# Altium project EDP_V3.PrjPcb
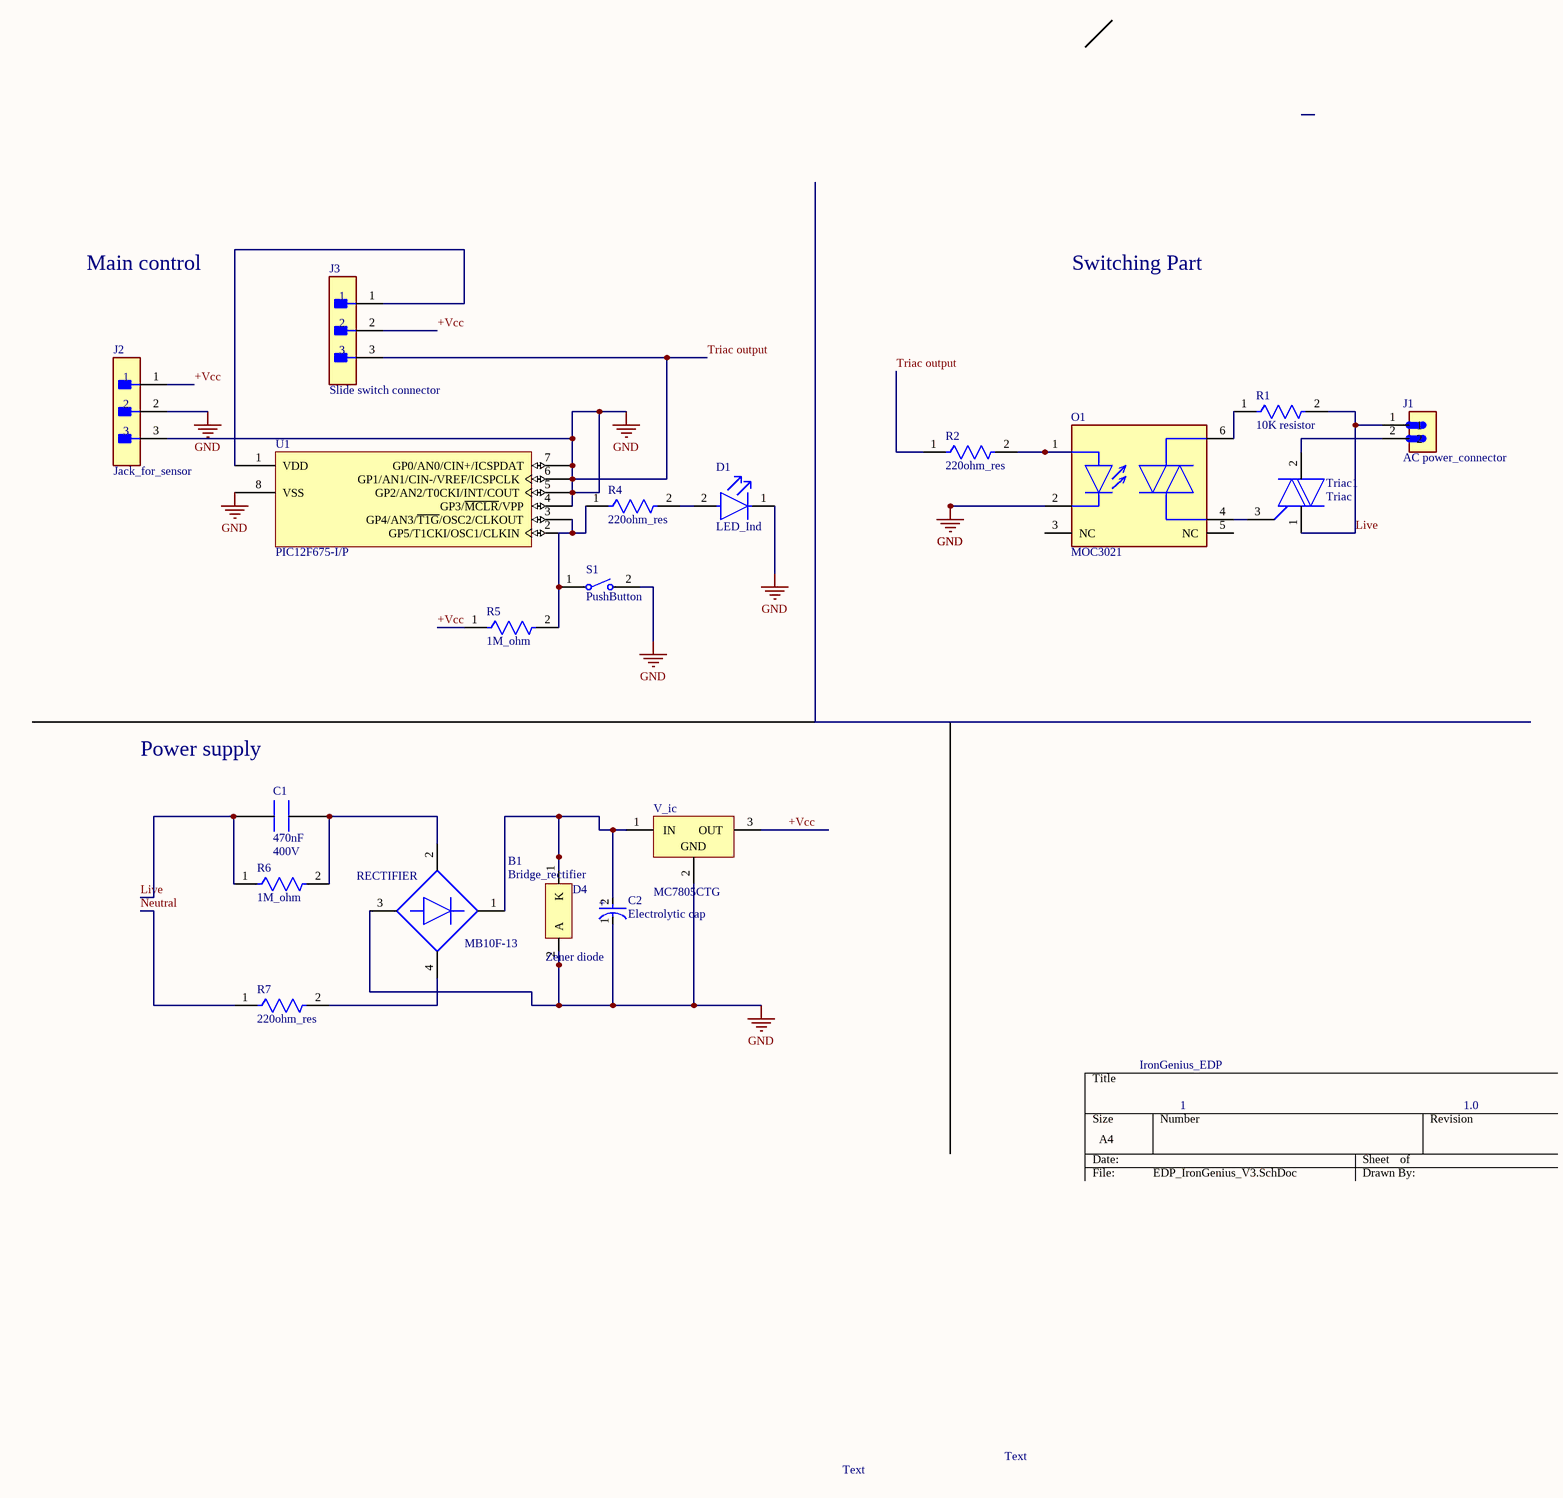
[diagram p0: EDP_IronGenius_V3.SchDoc]
1 sheet, 19 parts. Net scope: global (net labels, ports and power ports of the same name join across sheets).
Board file: EDP_V3.PcbDoc

## Sheet EDP_IronGenius_V3.SchDoc: IronGenius_EDP
size A4; Revision: 1.0; SheetNumber: 1; SheetTotal: 1

### Parts
B1  Bridge_rectifier  Manufacturer Part Number: MB10F-13  Diode Type: RECTIFIER  [Bridge rectifier]
C1  value 470nF  Rated AC Voltage (URac): 400V  [Capacitor 470nF 400V AC]
C2  Electrolytic cap  [Electrolytic cap]
D1  LED_Ind  [LED_ind]
D4  Zener diode  [Diode]
J1  AC power_connector  [AC power_connector]
J2  Jack_for_sensor  [Sensor_jack]
J3  Slide switch connector  [Sensor_jack]
O1  MOC3021  [DIP6]
R1  10K resistor  [10K resistor]
R2  220ohm_res  [220ohm_res]
R4  220ohm_res  [220ohm_res]
R5  1M_ohm  [1M_om]
R6  1M_ohm  [1M_om]
R7  220ohm_res  [220ohm_res]
S1  PushButton  [PushButton]
Triac1  Triac  [Triac BTA16-600]
U1  PIC12F675-I/P  [PDIP300-P8]
V_ic  MC7805CTG  [IC7805]

### Nets
Triac output: B1.3(-) C2.1(C) D1.1(C) D4.2(A) J2.2 J2.3 J3.3 O1.2(C) R2.1 S1.2 U1.4(GP3/~{MCLR}/VPP) U1.5(GP2/AN2/T0CKI/INT/COUT) U1.6(GP1/AN1/CIN-/VREF/ICSPCLK) U1.7(GP0/AN0/CIN+/ICSPDAT) U1.8(VSS) V_ic.2(GND)  [also labelled GND]
+Vcc: J2.1 J3.2 R5.1 V_ic.3(OUT)
Live: C1.P10 J1.1 R1.2 R6.1 Triac1.1(A1)
Neutral: R7.1
NetB1_1: B1.1(+) C2.2(A) D4.1(K) V_ic.1(IN)
NetB1_2: B1.2(1_~) C1.P9 R6.2
NetB1_4: B1.4(2_~) R7.2
NetD1_2: D1.2(A) R4.2
NetJ1_2: J1.2 Triac1.2(A2)
NetJ3_1: J3.1 U1.1(VDD)
NetO1_1: O1.1(A) R2.2
NetO1_4: O1.4(1_MAIN_TERM.) Triac1.3(G)
NetO1_6: O1.6(2_MAIN_TERM.) R1.1
NetR4_1: R4.1 R5.2 S1.1 U1.2(GP5/T1CKI/OSC1/CLKIN) U1.3(GP4/AN3/~{T1G}/OSC2/CLKOUT)

Not connected (* = marked no-connect by the designer): O1 3(NC) 5(NC)

### Notes on the sheet
- Main control
- Switching Part
- Power supply
- Text
- (in symbol Electrolytic cap) +

### Library data of the parts
B1 = Bridge_rectifier: Bridge Rectifier Diode, 1 Phase, 0.8A, 1000V V(RRM), Silicon; Manufacturer: Diodes; Supplier: Digikey; Supplier Part Number: MB10F-13DICT-ND; RoHS: Yes; Category: Diodes; Stock: 10908; Pricing: 1=0.56, 10=0.346, 100=0.2202, 500=0.16594, 1000=0.13963, 2000=0.13364 (USD); Terminal Finish: Tin; JESD-609 Code: e3; RoHS Compliant: Yes; Reach SVHC Compliant: No; ComponentLink1URL: https://datasheet.ciiva.com:443/pdfs/VipMasterIC/IC/DIOD/DIOD-S-A0003097097/DIOD-S-A0003097097-1.pdf?src-supplier=IHS+Markit; ComponentLink1Description: https://datasheet.ciiva.com:443/pdfs/VipMasterIC/IC/DIOD/DIOD-S-A0003097097/DIOD-S-A0003097097-1.pdf?src-supplier=IHS+Markit; ComponentLink2URL: https://www.diodes.com/assets/Datasheets/MB10F.pdf?src-supplier=Digikey; ComponentLink2Description: https://www.diodes.com/assets/Datasheets/MB10F.pdf?src-supplier=Digikey
C1 = Component_2: Film Capacitor, Polypropylene, 630V, 5% +Tol, 5% -Tol, 0.47uF, Through Hole Mount; pin to pad: P9>1 P10>2; Manufacturer: KEMET; Manufacturer Part Number: R76PR3470SE30J; Additional Feature: RATED AC VOLTAGE (V): 400; Supplier: Digikey; Supplier Part Number: 399-7615-ND; RoHS: Yes; Category: Film Capacitors; Stock: 336; Pricing: 1=3.32, 10=2.388, 50=1.9644, 480=1.56423, 960=1.47382, 1440=1.42641, 2880=1.35362, 5280=1.29756 (USD); Mounting Technology: Through Hole; Pins: 2; Dielectric Material: Polypropylene; Package Shape: Rectangular; Min Operating Temperature: -55°C; Max Operating Temperature: 85°C; Capacitor Type: FILM; Tolerance  (fill in as +-): 5%; Package Style: RadialMeter; Packaging: Bulk; Tolerance (fill in as +-): 5%; Rated DC Voltage (URdc): 630V; Termination: Wire; Length: 32mm; Width: 13mm; Height: 22mm; Terminal Pitch: 27.5mm; Reach SVHC Compliant: Yes; RoHS Compliant: Yes; ComponentLink1URL: https://datasheet.ciiva.com:443/pdfs/VipMasterIC/IC/KEME/KEME-S-A0009156830/KEME-S-A0009156830-1.pdf?src-supplier=IHS+Markit; ComponentLink1Description: https://datasheet.ciiva.com:443/pdfs/VipMasterIC/IC/KEME/KEME-S-A0009156830/KEME-S-A0009156830-1.pdf?src-supplier=IHS+Markit; ComponentLink2URL: http://www.mouser.com/ds/2/212/KEM_F3034_R76-458534.pdf?src-supplier=Mouser; ComponentLink2Description: http://www.mouser.com/ds/2/212/KEM_F3034_R76-458534.pdf?src-supplier=Mouser; ComponentLink3URL: https://search.kemet.com/component-edge/download/datasheet/R76PR3470SE30J.pdf?src-supplier=Digikey; ComponentLink3Description: https://search.kemet.com/component-edge/download/datasheet/R76PR3470SE30J.pdf?src-supplier=Digikey
C2 = Electrolytic cap: Aluminum Electrolytic Capacitor, Polarized, Aluminum (wet), 50V, 20% +Tol, 20% -Tol, 220uF, Through Hole Mount; Manufacturer: Panasonic; Manufacturer Part Number: EEU-FR1H221B; Manufacturer Series: FR; Dielectric Material: Aluminium; Leakage Current: 110uA; Ripple Current: 1.155A; Tan Delta: 0.1; Supplier: Digikey; Supplier Part Number: P15375CT-ND; RoHS: Yes; Category: Aluminum Electrolytic Capacitors; Pricing: 1=0.84, 10=0.53, 50=0.3992, 100=0.358 (USD); Mounting Technology: Through Hole; Pins: 2; Terminal Finish: Tin; Package Shape: Cylindrical; Min Operating Temperature: -40°C; Max Operating Temperature: 105°C; Polarity: Polarized; Value: 220uF; Capacitor Type: Aluminium; Tolerance  (fill in as +-): 20%; Package Style: RadialMeter; Packaging: Tape and Reel; Tolerance (fill in as +-): 20%; Rated DC Voltage (URdc): 50V; Termination: Wire; JESD-609 Code: e3; Series: EEU-FR; Diameter: 10mm; Length: 16mm; Terminal Pitch: 5mm; Reach SVHC Compliant: Yes; RoHS Compliant: Yes; ComponentLink1URL: https://datasheet.ciiva.com:443/pdfs/VipMasterIC/IC/PANA/PANA-S-A0009000947/PANA-S-A0009000947-1.pdf?src-supplier=IHS+Markit; ComponentLink1Description: https://datasheet.ciiva.com:443/pdfs/VipMasterIC/IC/PANA/PANA-S-A0009000947/PANA-S-A0009000947-1.pdf?src-supplier=IHS+Markit
D1 = LED_Ind: Single Color LED, Yellow, Tinted Diffused, T-1, 3mm; Manufacturer: Broadcom Avago; Shape: Round; Channels: 1; Forward Current: 7mA; Forward Voltage: 2.7V; Luminous Intensity-Nom: 2.1mcd; Viewing Angle: 50°; Lens Style: Diffused,Tinted; Overall Height: 4.445mm; Supplier: Digikey; Supplier Part Number: 516-1309-ND; Manufacturer Part Number: HLMP-1719; RoHS: Yes; Category: LEDs; Stock: 87102; Pricing: 1=0.42, 10=0.287, 100=0.2048, 500=0.1675, 1000=0.15521, 2000=0.14474, 6000=0.13128, 10000=0.12612, 26000=0.11801 (USD); Mounting Technology: Radial; Pins: 2; Color: Yellow; Color@wavelength: Yellow; Terminal Finish: Tin; Min Operating Temperature: -40°C; Max Operating Temperature: 100°C; Optoelectronic Device Type: SINGLE COLOR LED; Packaging: Bulk; JESD-609 Code: e3; T-code: T-1; Terminal Pitch: 2.54mm; Size: 3mm; Reach SVHC Compliant: Yes; RoHS Compliant: Yes; ComponentLink1URL: https://datasheet.ciiva.com:443/pdfs/VipMasterIC/IC/AVGO/AVGOS05570/AVGOS05570-1.pdf?src-supplier=IHS+Markit; ComponentLink1Description: https://datasheet.ciiva.com:443/pdfs/VipMasterIC/IC/AVGO/AVGOS05570/AVGOS05570-1.pdf?src-supplier=IHS+Markit; ComponentLink2URL: https://datasheet.ciiva.com/11773/0900766b800204ad-11773897.pdf?src-supplier=Rs; ComponentLink2Description: https://datasheet.ciiva.com/11773/0900766b800204ad-11773897.pdf?src-supplier=Rs; ComponentLink3URL: https://datasheet.ciiva.com/19482/253673-19482303.pdf?src-supplier=Jameco; ComponentLink3Description: https://datasheet.ciiva.com/19482/253673-19482303.pdf?src-supplier=Jameco; ComponentLink4URL: https://datasheet.ciiva.com/15117/getdatasheetpartid-111138-15117505.pdf?src-supplier=Verical; ComponentLink4Description: https://datasheet.ciiva.com/15117/getdatasheetpartid-111138-15117505.pdf?src-supplier=Verical; ComponentLink5URL: https://datasheet.ciiva.com/1244/1715378-1244676.pdf?src-supplier=Element14; ComponentLink5Description: https://datasheet.ciiva.com/1244/1715378-1244676.pdf?src-supplier=Element14; ComponentLink6URL: https://datasheet.ciiva.com/29334/180618-da-01-en-led-3mm-hlmp-1719-gelb-29334897.pdf?src-supplier=Conrad; ComponentLink6Description: https://datasheet.ciiva.com/29334/180618-da-01-en-led-3mm-hlmp-1719-gelb-29334897.pdf?src-supplier=Conrad; ComponentLink7URL: https://datasheet.ciiva.com/14183/efhlmp17x-47xx-en-14183894.pdf?src-supplier=Distrelec; ComponentLink7Description: https://datasheet.ciiva.com/14183/efhlmp17x-47xx-en-14183894.pdf?src-supplier=Distrelec; ComponentLink8URL: https://datasheet.ciiva.com/14605/70157746-14605453.pdf?src-supplier=Allied+Electronics; ComponentLink8Description: https://datasheet.ciiva.com/14605/70157746-14605453.pdf?src-supplier=Allied+Electronics
D4 = Diode: Rectifier Diode, 1 Phase, 1 Element, 1A, 1000V V(RRM), Silicon, DO-41; Manufacturer: ON Semiconductor; Manufacturer Part Number: 1N4007RLG; Package Body Material: Plastic; Case Connection: Isolated; Forward Voltage: 1.1V; Non-rep Pk Forward Current-Max: 30A; Number of Elements: 1; Rep Pk Reverse Voltage-Max: 1kV; Surface Mount: No; Time @ Peak Reflow Temperature-Max (s): 40s; Qualification Status: Not Qualified; Supplier: Digikey; Supplier Part Number: 1N4007RLGOSCT-ND; RoHS: Yes; Category: Rectifier Diodes; Stock: 2581; Pricing: 1=0.19, 10=0.116, 100=0.0724, 500=0.0535, 1000=0.04635, 2000=0.04211 (USD); Pins: 2; Diode Element Material: SILICON; Package Shape: Round; Terminal Finish: Tin; Min Operating Temperature: -65°C; Max Operating Temperature: 175°C; Diode Type: RECTIFIER; JESD-609 Code: e3; JESD-30 Code: O-PALF-W2; Max Output current: 1A; Package Style: LONG FORMMeter; Terminal Form: Wire; Terminal Position: AXIAL; Peak Reflow Temperature (Cel): 260°C; RoHS Compliant: Yes; Reach SVHC Compliant: No; JEDEC-95 Code: DO-41; ComponentLink1URL: https://datasheet.ciiva.com:443/pdfs/VipMasterIC/IC/ONSM/ONSM-S-A0005492811/ONSM-S-A0005492811-1.pdf?src-supplier=IHS+Markit; ComponentLink1Description: https://datasheet.ciiva.com:443/pdfs/VipMasterIC/IC/ONSM/ONSM-S-A0005492811/ONSM-S-A0005492811-1.pdf?src-supplier=IHS+Markit; ComponentLink2URL: https://datasheet.ciiva.com/915/1n4001-d-915344.pdf?src-supplier=Digikey; ComponentLink2Description: https://datasheet.ciiva.com/915/1n4001-d-915344.pdf?src-supplier=Digikey; ComponentLink3URL: https://datasheet.ciiva.com/915/1n4001-d-915345.pdf?src-supplier=Digikey; ComponentLink3Description: https://datasheet.ciiva.com/915/1n4001-d-915345.pdf?src-supplier=Digikey; ComponentLink4URL: https://datasheet.ciiva.com/3304/1n4001-d-3304216.pdf?src-supplier=Avnet; ComponentLink4Description: https://datasheet.ciiva.com/3304/1n4001-d-3304216.pdf?src-supplier=Avnet
J1 = AC power_connector: Barrier Strip Terminal Block, 10A, 1 Row(s), 1 Deck(s); Manufacturer: On-Shore Technology; Manufacturer Part Number: OSTTE020104; Fastening Method: SCREW; Additional Feature: STANDARD: UL 94V-0, THERMOPLASTIC; Number of Decks: 1; Number of Ways: 2; Voltage Rating: 125V; Wire/Cable Gauge: 16AWG; Safety Approval: UL,CUL; Supplier: Arrow Electronics; Supplier Part Number: OSTTE020104; RoHS: Yes; Category: Terminal Blocks; Stock: 2; Pricing: 1=0.2592, 10=0.193, 25=0.1668, 50=0.1485, 100=0.1326, 250=0.1154, 500=0.1046, 1000=0.0957, 5000=0.0823 (USD); Mounting Technology: Board; Number of Rows: 1; Current Rating: 10A; Terminal and Terminal Block Type: BARRIER STRIP TERMINAL BLOCK; Reach SVHC Compliant: Yes; RoHS Compliant: Yes; ComponentLink1URL: https://datasheet.ciiva.com:443/pdfs/VipMasterIC/IC/ONST/ONST-S-A0002844285/ONST-S-A0002844285-1.pdf?src-supplier=IHS+Markit; ComponentLink1Description: https://datasheet.ciiva.com:443/pdfs/VipMasterIC/IC/ONST/ONST-S-A0002844285/ONST-S-A0002844285-1.pdf?src-supplier=IHS+Markit; ComponentLink2URL: http://www.on-shore.com/wp-content/uploads/2015/09/osttexx0164.pdf?src-supplier=Verical; ComponentLink2Description: http://www.on-shore.com/wp-content/uploads/2015/09/osttexx0164.pdf?src-supplier=Verical; ComponentLink3URL: http://www.on-shore.com/wp-content/uploads/2015/09/osttexx0164.pdf?src-supplier=Digikey; ComponentLink3Description: http://www.on-shore.com/wp-content/uploads/2015/09/osttexx0164.pdf?src-supplier=Digikey; ComponentLink4URL: http://www.on-shore.com/wp-content/uploads/2015/09/osttexx0164.pdf?src-supplier=Arrow+Electronics; ComponentLink4Description: http://www.on-shore.com/wp-content/uploads/2015/09/osttexx0164.pdf?src-supplier=Arrow+Electronics
J2 J3 = Jack_for_sensor: Conn Shrouded Header (4 Sides) HDR 3 POS 2mm Solder RA Side Entry Thru-Hole Box; Manufacturer: JST; Manufacturer Part Number: S3B-PH-K-S(LF)(SN); Supplier: Mouser; Supplier Part Number: 306-S3BPHKSLFSN; RoHS: Yes; Category: Headers and Wire Housings; Stock: 230157; Pricing: 1=0.15, 10=0.125, 50=0.125, 100=0.103, 1000=0.072, 10000=0.067 (USD); ComponentLink1URL: http://www.farnell.com/datasheets/2057211.pdf?src-supplier=Farnell; ComponentLink1Description: http://www.farnell.com/datasheets/2057211.pdf?src-supplier=Farnell; ComponentLink2URL: https://datasheet.octopart.com/S3B-PH-K-S%28LF%29%28SN%29-JST-datasheet-56537.pdf?src-supplier=Future+Electronics; ComponentLink2Description: https://datasheet.octopart.com/S3B-PH-K-S%28LF%29%28SN%29-JST-datasheet-56537.pdf?src-supplier=Future+Electronics; ComponentLink3URL: http://www.farnell.com/datasheets/2057211.pdf?src-supplier=Newark; ComponentLink3Description: http://www.farnell.com/datasheets/2057211.pdf?src-supplier=Newark; ComponentLink4URL: http://www.jst-mfg.com/product/pdf/eng/ePH.pdf?src-supplier=Digikey; ComponentLink4Description: http://www.jst-mfg.com/product/pdf/eng/ePH.pdf?src-supplier=Digikey; ComponentLink5URL: http://datasheet.octopart.com/S3B-PH-K-S-%28LF%29%28SN%29-JST-datasheet-15068535.pdf?src-supplier=TME; ComponentLink5Description: http://datasheet.octopart.com/S3B-PH-K-S-%28LF%29%28SN%29-JST-datasheet-15068535.pdf?src-supplier=TME; ComponentLink6URL: https://datasheet.octopart.com/S3B-PH-K-S%28LF%29%28SN%29-JST-datasheet-147762421.pdf?src-supplier=LKR; ComponentLink6Description: https://datasheet.octopart.com/S3B-PH-K-S%28LF%29%28SN%29-JST-datasheet-147762421.pdf?src-supplier=LKR
O1 = MOC3021: OPTOISOLATOR 4.17KV TRIAC 6DIP; Manufacturer: ON Semiconductor / Fairchild; Manufacturer Part Number: MOC3021M; Supplier: Digikey; Supplier Part Number: MOC3021MFS-ND; RoHS: Yes; Category: Optocouplers; Stock: 1948; Pricing: 1=0.85, 50=0.4714, 100=0.4321, 500=0.36196, 1000=0.33895, 2000=0.31941, 5000=0.29807, 10000=0.28477, 25000=0.27027 (USD); ComponentLink1URL: https://datasheet.ciiva.com/30526/moc3010m-30526103.pdf?src-supplier=Digikey; ComponentLink1Description: https://datasheet.ciiva.com/30526/moc3010m-30526103.pdf?src-supplier=Digikey; ComponentLink2URL: https://datasheet.ciiva.com/48435/oemoc301xm-moc302xm-e-48435605.pdf?src-supplier=Distrelec; ComponentLink2Description: https://datasheet.ciiva.com/48435/oemoc301xm-moc302xm-e-48435605.pdf?src-supplier=Distrelec
R1 = 10K resistor: Fixed Resistor, Thin Film, 0.6W, 1000ohm, 350V, 1% +/-Tol, 50ppm/Cel, Through Hole Mount; Manufacturer: Vishay; Manufacturer Part Number: MRS25000C1001FCT00; Power: 600mW; Rated Temperature: 70°C; Value: 1kR; Temperature Coefficient (ppm/Cel): 50; Additional Feature: RATED AC VOLTAGE: 350V; Lead Length: 28mm; Package Length: 6.5mm; Lead Diameter: 0.6mm; Supplier: Arrow Electronics; Supplier Part Number: MRS25000C1001FCT00; RoHS: Yes; Category: Through-Hole Resistors; Stock: 5000; Pricing: 5000=0.0494, 10000=0.0461, 15000=0.0458, 25000=0.0443, 35000=0.0429, 50000=0.0414, 125000=0.0384, 250000=0.0366 (USD); Mounting Technology: Through Hole; Pins: 2; Terminal Finish: Tin; Min Operating Temperature: -55°C; Max Operating Temperature: 155°C; Tolerance: 1%; JESD-609 Code: e3; Resistor Type: FIXED RESISTOR; Packaging: Ammo Pack; Technology: THIN FILM; Termination: Wire; Construction: Tubular; Working Voltage: 350V; Package Style: AXIAL; Reach SVHC Compliant: Yes; RoHS Compliant: Yes; ComponentLink1URL: https://datasheet.ciiva.com:443/pdfs/VipMasterIC/IC/VISH/VISH-S-A0002281164/VISH-S-A0002281164-1.pdf?src-supplier=IHS+Markit; ComponentLink1Description: https://datasheet.ciiva.com:443/pdfs/VipMasterIC/IC/VISH/VISH-S-A0002281164/VISH-S-A0002281164-1.pdf?src-supplier=IHS+Markit; ComponentLink2URL: https://datasheet.ciiva.com/11823/0900766b80d9a016-11823229.pdf?src-supplier=Rs; ComponentLink2Description: https://datasheet.ciiva.com/11823/0900766b80d9a016-11823229.pdf?src-supplier=Rs; ComponentLink3URL: https://datasheet.ciiva.com/8401/mrs16m25-8401227.pdf?src-supplier=Avnet; ComponentLink3Description: https://datasheet.ciiva.com/8401/mrs16m25-8401227.pdf?src-supplier=Avnet; ComponentLink4URL: https://datasheet.ciiva.com/16464/mrs16m25-16464630.pdf?src-supplier=Future+Electronics; ComponentLink4Description: https://datasheet.ciiva.com/16464/mrs16m25-16464630.pdf?src-supplier=Future+Electronics; ComponentLink5URL: https://datasheet.ciiva.com/7836/mrs16m25-7836234.pdf?src-supplier=Element14; ComponentLink5Description: https://datasheet.ciiva.com/7836/mrs16m25-7836234.pdf?src-supplier=Element14; ComponentLink6URL: https://datasheet.ciiva.com/28605/1911198-28605880.pdf?src-supplier=Element14; ComponentLink6Description: https://datasheet.ciiva.com/28605/1911198-28605880.pdf?src-supplier=Element14; ComponentLink7URL: https://datasheet.ciiva.com/46412/1756157-46412631.pdf?src-supplier=Element14; ComponentLink7Description: https://datasheet.ciiva.com/46412/1756157-46412631.pdf?src-supplier=Element14
R2 R4 R7 = 220ohm_res: Fixed Resistor, Metal Film, 0.25W, 220ohm, 200V, 1% +/-Tol, 50ppm/Cel, Through Hole Mount; Manufacturer: Vishay Beyschlag; Manufacturer Part Number: MBA02040C2200FC100; Power: 400mW; Rated Temperature: 70°C; Value: 220R; Temperature Coefficient (ppm/Cel): 50; Package Length: 3.6mm; Lead Diameter: 0.5mm; Lead Length: 29mm; Reference Standard: AEC-Q200; Supplier: Arrow Electronics; Supplier Part Number: MBA02040C2200FC100; RoHS: Yes; Category: Through-Hole Resistors; Stock: 1000; Pricing: 1=0.4263, 10=0.3254, 25=0.2532, 100=0.2246, 250=0.2007, 500=0.1662, 1000=0.1282 (USD); Mounting Technology: Through Hole; Pins: 2; Package Shape: Tubular; Terminal Finish: Tin; Min Operating Temperature: -55°C; Max Operating Temperature: 155°C; Tolerance: 1%; JESD-609 Code: e3; Resistor Type: FIXED RESISTOR; Packaging: Bulk; Technology: THIN FILM; Termination: Wire; Construction: Tubular; Package Style: AXIAL; Working Voltage: 200V; Reach SVHC Compliant: Yes; RoHS Compliant: Yes; ComponentLink1URL: https://datasheet.ciiva.com:443/pdfs/VipMasterIC/IC/VISH/VISH-S-A0005972005/VISH-S-A0005972005-1.pdf?src-supplier=IHS+Markit; ComponentLink1Description: https://datasheet.ciiva.com:443/pdfs/VipMasterIC/IC/VISH/VISH-S-A0005972005/VISH-S-A0005972005-1.pdf?src-supplier=IHS+Markit; ComponentLink2URL: http://uk.rs-online.com/webdocs/09bb/0900766b809bb010.pdf?src-supplier=Rs; ComponentLink2Description: http://uk.rs-online.com/webdocs/09bb/0900766b809bb010.pdf?src-supplier=Rs; ComponentLink3URL: http://www.alliedelec.com/m/d/72a9b4b9281933b6a3b8fa3f9583e3eb.pdf?src-supplier=Allied+Electronics; ComponentLink3Description: http://www.alliedelec.com/m/d/72a9b4b9281933b6a3b8fa3f9583e3eb.pdf?src-supplier=Allied+Electronics; ComponentLink4URL: http://www.mouser.com/ds/2/427/mbxsma-239744.pdf?src-supplier=Mouser; ComponentLink4Description: http://www.mouser.com/ds/2/427/mbxsma-239744.pdf?src-supplier=Mouser; ComponentLink5URL: http://www.vishay.com/docs/28766/28766.pdf?src-supplier=Avnet; ComponentLink5Description: http://www.vishay.com/docs/28766/28766.pdf?src-supplier=Avnet; ComponentLink6URL: http://www.vishay.com/docs/28766/mbxsma.pdf?src-supplier=Digikey; ComponentLink6Description: http://www.vishay.com/docs/28766/mbxsma.pdf?src-supplier=Digikey; ComponentLink7URL: https://datasheet.octopart.com/MBA02040C2200FC100-Vishay-datasheet-62042582.pdf?src-supplier=TME; ComponentLink7Description: https://datasheet.octopart.com/MBA02040C2200FC100-Vishay-datasheet-62042582.pdf?src-supplier=TME
R5 R6 = 1M_ohm: Fixed Resistor, Metal Film, 0.5W, 1000000ohm, 3500V, 1% +/-Tol, 200ppm/Cel, Through Hole Mount; Manufacturer: Vishay BCcomponents; Manufacturer Part Number: HVR3700001004FR500; Power: 500mW; Rated Temperature: 70°C; Value: 1MR; Temperature Coefficient (ppm/Cel): 200; Working Voltage: 3.5kV; Lead Length: 20.25mm; Package Length: 12mm; Lead Diameter: 0.78mm; Supplier: Arrow Electronics; Supplier Part Number: HVR3700001004FR500; RoHS: Yes; Category: Through-Hole Resistors; Stock: 1088; Pricing: 1=0.4582, 10=0.4566, 25=0.4549, 100=0.4533, 250=0.4517, 500=0.4501, 1000=0.4485 (USD); Mounting Technology: Through Hole; Pins: 2; Package Shape: Tubular; Terminal Finish: Tin; Min Operating Temperature: -55°C; Max Operating Temperature: 155°C; Tolerance: 1%; JESD-609 Code: e3; Resistor Type: FIXED RESISTOR; Construction: Cylindrical; Technology: METAL FILM; Termination: Wire; Packaging: Tape and Reel; Package Style: AXIAL; Reach SVHC Compliant: Yes; RoHS Compliant: Yes; ComponentLink1URL: https://datasheet.ciiva.com:443/pdfs/VipMasterIC/IC/VISH/VISH-S-A0005972020/VISH-S-A0005972020-1.pdf?src-supplier=IHS+Markit; ComponentLink1Description: https://datasheet.ciiva.com:443/pdfs/VipMasterIC/IC/VISH/VISH-S-A0005972020/VISH-S-A0005972020-1.pdf?src-supplier=IHS+Markit; ComponentLink2URL: https://datasheet.ciiva.com/5487/hvr25-110254-5487353.pdf?src-supplier=Mouser; ComponentLink2Description: https://datasheet.ciiva.com/5487/hvr25-110254-5487353.pdf?src-supplier=Mouser; ComponentLink3URL: https://datasheet.ciiva.com/5897/653840-5897692.pdf?src-supplier=Farnell; ComponentLink3Description: https://datasheet.ciiva.com/5897/653840-5897692.pdf?src-supplier=Farnell; ComponentLink4URL: https://datasheet.ciiva.com/29922/hvr2537-29922493.pdf?src-supplier=Avnet; ComponentLink4Description: https://datasheet.ciiva.com/29922/hvr2537-29922493.pdf?src-supplier=Avnet; ComponentLink5URL: https://datasheet.ciiva.com/48465/hvr2537-48465885.pdf?src-supplier=Avnet; ComponentLink5Description: https://datasheet.ciiva.com/48465/hvr2537-48465885.pdf?src-supplier=Avnet; ComponentLink6URL: https://datasheet.ciiva.com/2712/hvr2537-2712546.pdf?src-supplier=Digikey; ComponentLink6Description: https://datasheet.ciiva.com/2712/hvr2537-2712546.pdf?src-supplier=Digikey; ComponentLink7URL: https://datasheet.ciiva.com/2712/hvr2537-2712547.pdf?src-supplier=Digikey; ComponentLink7Description: https://datasheet.ciiva.com/2712/hvr2537-2712547.pdf?src-supplier=Digikey; ComponentLink8URL: https://datasheet.ciiva.com/46448/653840-46448778.pdf?src-supplier=Element14; ComponentLink8Description: https://datasheet.ciiva.com/46448/653840-46448778.pdf?src-supplier=Element14; ComponentLink9URL: https://datasheet.ciiva.com/46412/653840-46412630.pdf?src-supplier=Element14; ComponentLink9Description: https://datasheet.ciiva.com/46412/653840-46412630.pdf?src-supplier=Element14
S1 = PushButton: Keypad Switch, 1 Switches, SPST, Momentary, 0.05A, 24VDC, 2.06N, 4 PCB Hole Cnt, Solder Terminal, Through Hole-straight; Manufacturer: TE Connectivity; Manufacturer Part Number: 2-1825910-7; End Contact Plating: Silver; Actuator Color: Black; End Contact Material: Copper Alloy; Actuator Material: Nylon; Contact Current(DC)-Max: 50mA; Contact DC Max Rating R Load: .05A@24VDC; Contact Voltage(DC)-Max: 24V; Circuit Configuration: 1X1; Number of Switches: 1; Actuator Angle: 0°; Contact Function: OFF-(ON); Contact Resistance: 0.1mR; Dielectric Withstand Volts: 500VACV; Insulation Resistance: 100MR; PCB Hole Count: 4; Actuator Travel: 0.254mm; Body Breadth: 5.99mm; Body Height: 3.61mm; Actuator Length: 0.37inch; Supplier: Digikey; Supplier Part Number: 450-1642-ND; RoHS: Yes; Category: Pushbutton Switches; Stock: 45531; Pricing: 1=0.14, 10=0.126, 25=0.1184, 100=0.1065, 250=0.09884, 750=0.0902, 1500=0.08513, 3000=0.08042, 5250=0.07691 (USD); Mounting Technology: Through Hole; Contact Material: Copper Alloy; Center Contact Plating: Silver; Housing Material: Nylon; Terminal Material: Copper Alloy; Min Operating Temperature: -35°C; Max Operating Temperature: 85°C; Switch Action: MOMENTARY; Switch Function: SPST; Switch Type: Keypad; Termination: Solder; Operating Force-Max: 2.06N; Actuator Type: Pushbutton; Body Length or Diameter: 5.99mm; Terminal Length: 0.138inch; RoHS Compliant: Yes; Reach SVHC Compliant: Yes; ComponentLink1URL: https://www.te.com:443/usa-en/product-2-1825910-7.datasheet.pdf?src-supplier=IHS+Markit; ComponentLink1Description: https://www.te.com:443/usa-en/product-2-1825910-7.datasheet.pdf?src-supplier=IHS+Markit; ComponentLink2URL: https://datasheet.ciiva.com/30233/mrw444-30233541.pdf?src-supplier=Onlinecomponents.com; ComponentLink2Description: https://datasheet.ciiva.com/30233/mrw444-30233541.pdf?src-supplier=Onlinecomponents.com
Triac1 = Triac: Snubberless TRIAC, 600V V(DRM), 16A I(T)RMS, TO-220AB; Manufacturer: STMicroelectronics; Manufacturer Part Number: BTA16-600CWRG; Package Body Material: Plastic; Case Connection: Isolated; Hold Current: 35mA; Leakage Current-Max: 2mA; Number of Elements: 1; Surface Mount: No; Additional Feature: UL RECOGNIZED; Qualification Status: Not Qualified; Supplier: Mouser; Supplier Part Number: 511-BTA16-600CW; RoHS: Yes; Category: TRIACs; Stock: 7; Pricing: 1=1.94, 10=1.47, 50=0.913, 100=0.817, 1000=0.525, 10000=0.497 (USD); Pins: 3; Package Shape: Rectangular; Terminal Finish: Tin; Min Operating Temperature: -40°C; Max Operating Temperature: 125°C; JESD-609 Code: e3; JESD-30 Code: R-PSFM-T3; Package Style: FLANGE MOUNTMeter; Repetitive Peak Off-state Voltage: 600V; RMS Current (Irms): 16A; Terminal Form: Through Hole; Terminal Position: SINGLE; RoHS Compliant: Yes; Reach SVHC Compliant: No; JEDEC-95 Code: TO-220AB; ComponentLink1URL: https://datasheet.ciiva.com:443/pdfs/VipMasterIC/IC/SGST/SGST-S-A0005239301/SGST-S-A0005239301-1.pdf?src-supplier=IHS+Markit; ComponentLink1Description: https://datasheet.ciiva.com:443/pdfs/VipMasterIC/IC/SGST/SGST-S-A0005239301/SGST-S-A0005239301-1.pdf?src-supplier=IHS+Markit; ComponentLink2URL: https://datasheet.ciiva.com/15140/getdatasheetpartid-69796-15140332.pdf?src-supplier=Verical; ComponentLink2Description: https://datasheet.ciiva.com/15140/getdatasheetpartid-69796-15140332.pdf?src-supplier=Verical; ComponentLink3URL: https://datasheet.ciiva.com/1197/1699992-1197183.pdf?src-supplier=Element14; ComponentLink3Description: https://datasheet.ciiva.com/1197/1699992-1197183.pdf?src-supplier=Element14; ComponentLink4URL: https://datasheet.ciiva.com/1198/1699992-1198140.pdf?src-supplier=Element14; ComponentLink4Description: https://datasheet.ciiva.com/1198/1699992-1198140.pdf?src-supplier=Element14; ComponentLink5URL: https://datasheet.ciiva.com/16342/cd00002265-16342871.pdf?src-supplier=Future+Electronics; ComponentLink5Description: https://datasheet.ciiva.com/16342/cd00002265-16342871.pdf?src-supplier=Future+Electronics
U1 = CMP-0190-00021-1: RISC Microcontroller, 8-Bit, FLASH, PIC CPU, 20MHz, CMOS, PDIP8; Manufacturer: Microchip; Note1: Refer to data sheet (DS41190F) for details of supply voltage range under different conditions.; Package Body Material: Plastic; Number of I/O Lines: 6; Power Supplies: 2.5; Max Supply Current: 15mA; Max Supply Voltage: 5.5V; Min Supply Voltage: 4.5V; Nominal Supply Voltage: 5V; Surface Mount: No; Peripherals: POR,WDT; Package Equivalence Code: DIP8,.3; Qualification Status: Not Qualified; DatasheetVersion: revF, Sep-2009; Code_JEDEC: MS-001; PackageVersion: revBB, Aug-2009; PackageDescription: 8-Lead Plastic Dual In-Line (P) - 300 mil Body [PDIP]; PackageReference: PDIP300-P8; Supplier: Arrow Electronics; Supplier Part Number: PIC12F675-I/P; Manufacturer Part Number: PIC12F675-I/P; RoHS: Yes; Category: Microcontrollers; Stock: 273; Pricing: 60=1.483 (USD); Case/Package: DIP; Pins: 8; Package Shape: Rectangular; Terminal Finish: Tin; Min Operating Temperature: -40°C; Max Operating Temperature: 85°C; JESD-609 Code: e3; Clock Frequency: 20MHz; JESD-30 Code: R-PDIP-T8; Technology: CMOS; Terminal Form: Through Hole; Terminal Position: DUAL; Length: 9.27mm; Width: 7.62mm; Height - Seated (Max): 5.334mm; Terminal Pitch: 2.54mm; Reach SVHC Compliant: Yes; RoHS Compliant: Yes; Temperature Grade: INDUSTRIAL; ComponentLink1URL: https://datasheet.ciiva.com:443/pdfs/VipMasterIC/IC/MCHP/MCHPS03141/MCHPS03141-1.pdf?src-supplier=IHS+Markit; ComponentLink1Description: https://datasheet.ciiva.com:443/pdfs/VipMasterIC/IC/MCHP/MCHPS03141/MCHPS03141-1.pdf?src-supplier=IHS+Markit; ComponentLink2URL: https://datasheet.ciiva.com/1487/41190g-1487425.pdf?src-supplier=Digikey; ComponentLink2Description: https://datasheet.ciiva.com/1487/41190g-1487425.pdf?src-supplier=Digikey
V_ic = MC7805CTG: Fixed Positive Standard Regulator, 5VBIPolar; Manufacturer: ON Semiconductor; Dropout Voltage1-Nom: 2V; Input Voltage Absolute-Max: 35V; Max Supply Voltage: 20V; Min Input Voltage: 7.5V; Channels: 1; Output Current1-Max: 1A; Output Voltage1-Max: 5.25V; Output Voltage1-Min: 4.75V; Output Voltage1-Nom: 5V; Regulator Type: FIXED POSITIVE SINGLE OUTPUT STANDARD REGULATOR; Surface Mount: No; Voltage Tolerance-Max: 5%; Package Equivalence Code: SIP3,.1TB; Time @ Peak Reflow Temperature-Max (s): 40s; Qualification Status: Not Qualified; Supplier: Arrow Electronics; Supplier Part Number: MC7805CTG; Manufacturer Part Number: MC7805CTG; RoHS: Yes; Category: Voltage Regulators - Linear; Stock: 66265; Pricing: 1=0.5785, 10=0.4128, 25=0.345, 100=0.3219, 250=0.2882, 1000=0.2673, 2500=0.2314, 10000=0.1988, 20000=0.1969 (USD); Pins: 3; Package Shape: Rectangular; Terminal Finish: Tin; Adjustability: FIXED; Number of Outputs: 1; Operating Temperature, TJ-Max: 125°C; Operating Temperature, TJ-Min: 0°C; Packaging: Rail/Tube; Technology: BIPOLAR; Terminal Form: Through Hole; Terminal Position: SINGLE; JESD-609 Code: e3; Peak Reflow Temperature (Cel): 260°C; Terminal Pitch: 2.54mm; RoHS Compliant: Yes; Reach SVHC Compliant: No; ComponentLink1URL: https://datasheet.ciiva.com:443/pdfs/VipMasterIC/IC/ONSM/ONSM-S-A0009067490/ONSM-S-A0009067422-1.pdf?src-supplier=IHS+Markit; ComponentLink1Description: https://datasheet.ciiva.com:443/pdfs/VipMasterIC/IC/ONSM/ONSM-S-A0009067490/ONSM-S-A0009067422-1.pdf?src-supplier=IHS+Markit